# EAGLE schematic bb-meter-mk-1.0 (EAGLE 6.5.0)
DESIGNER: schizobovine <sean@yak.net
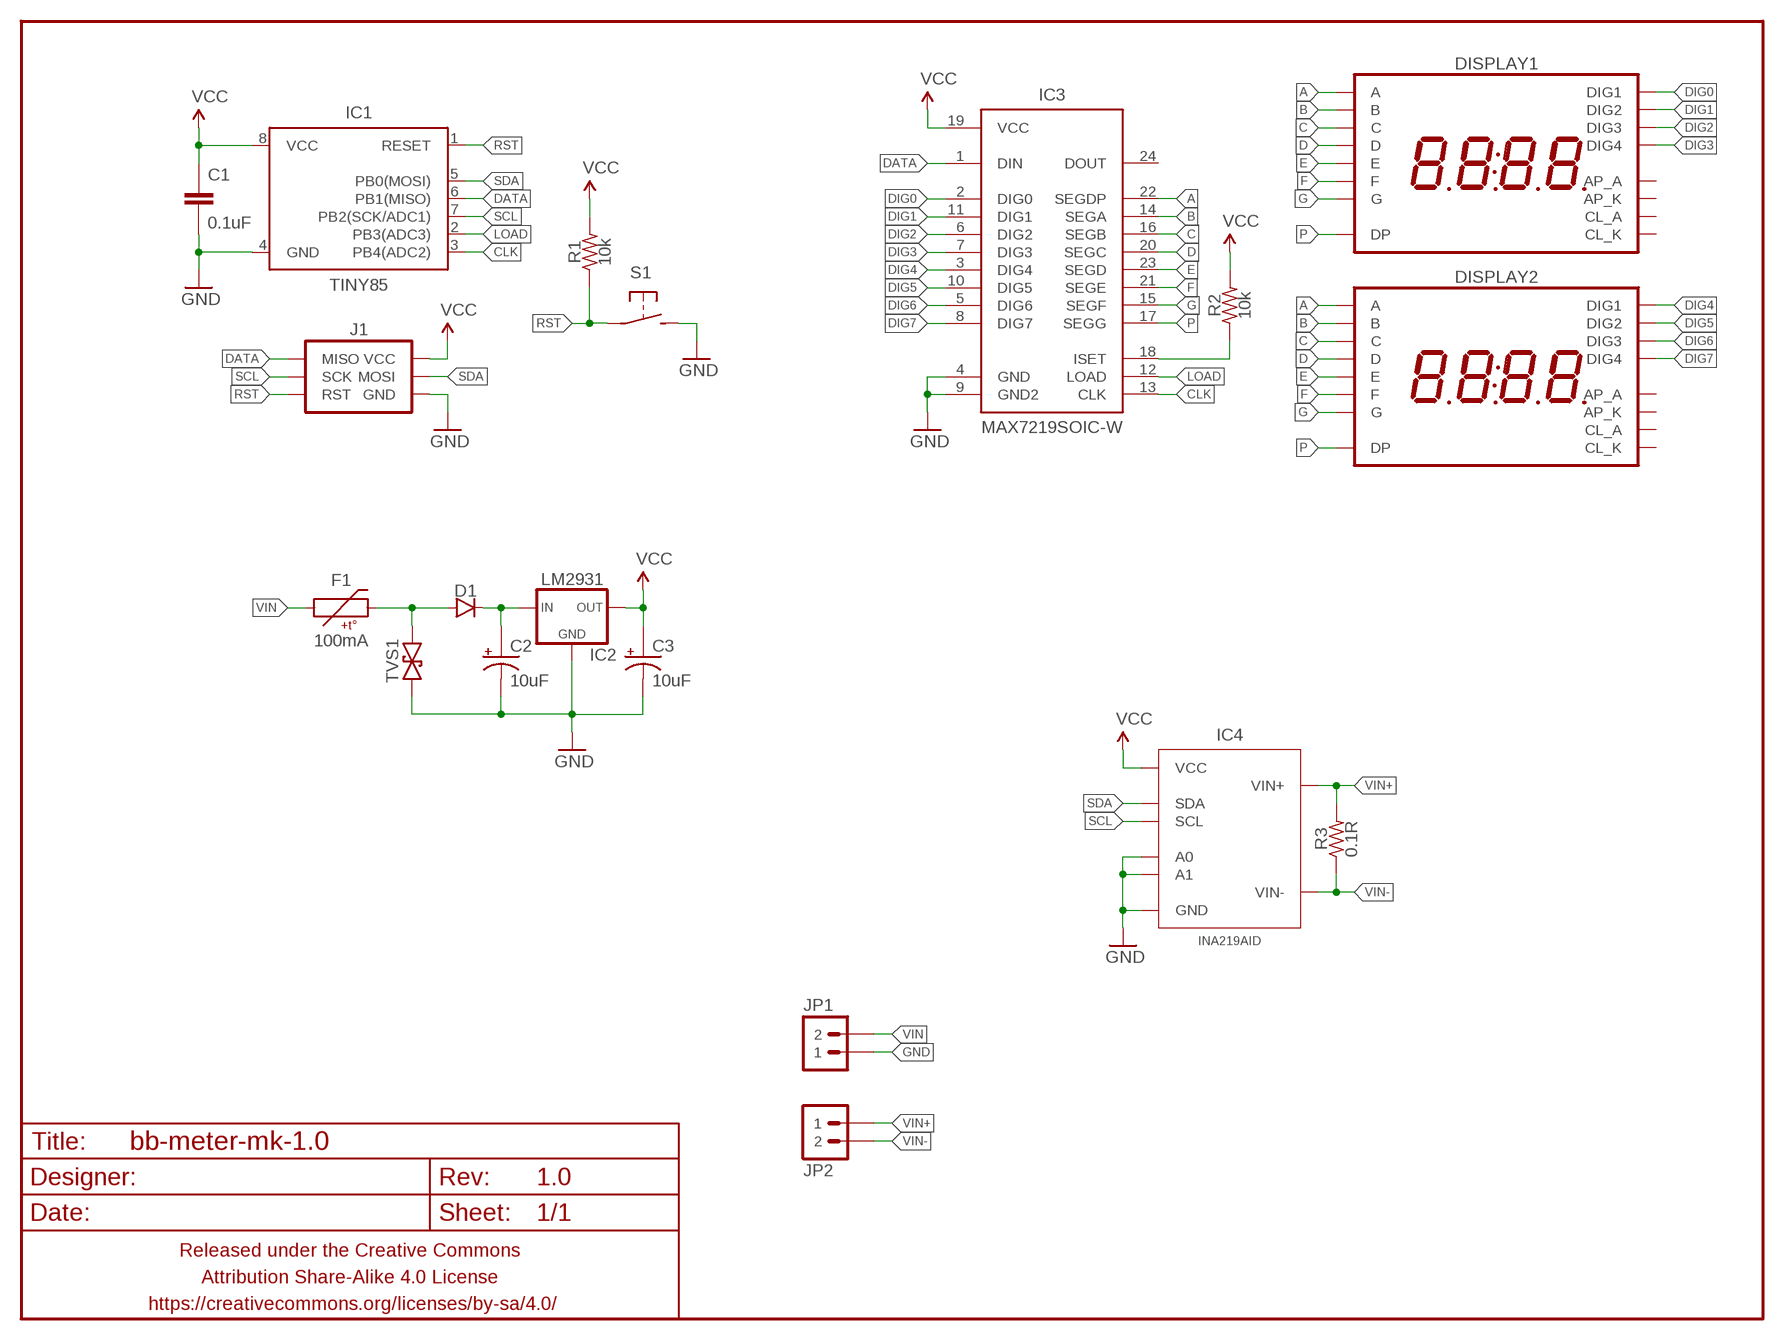
[diagram p0: schematic, sheet 1]

## Parts
C1  0.1uF  CAPACITOR-CERAMIC025-024X044  [C025-024X044]
C2  10uF  CAPACITOR-POLARIZEDE2.5-5  [E2,5-5]
C3  10uF  CAPACITOR-POLARIZEDE2.5-5  [E2,5-5]
D1  DIODEPTH-10.68MM  [DIODE-10.16MM]
DISPLAY1  7SEG_4DIGIT_COLON_APOS  [7SEG_4DIG_10MM]
DISPLAY2  7SEG_4DIGIT_COLON_APOS  [7SEG_4DIG_10MM]
F1  100mA  PTCPTH-5.08MM  [PTC-PTH-5.08MM]
FRAME1  FRAME-LETTERNO_PACKAGE  [DUMMY]
IC1  TINY85  ATTINY45TINY85-20-DIP  [DIP08]
IC2  LM2931  V_REG_78XXTO-92-INLINE  [TO-92-AMMO]
IC3  MAX7219SOIC-W  [SO24W]
IC4  INA219AID  INA219SOIC8  [SO08]
J1  AVR_SPI_PRG_6PTH  [2X3]
JP1  M02PTH-CENTERED-R+  [1X02-CENTER-R+]
JP2  M02PTH-CENTERED  [1X02-CENTER]
R1  10k  RESISTORPTH-AXIAL-6.35MM  [RESISTOR-AXIAL-PTH-6.35MM]
R2  10k  RESISTORR0805  [R0805]
R3  0.1R  RESISTORPTH-AXIAL-10.16MM  [RESISTOR-AXIAL-PTH-10.16MM]
S1  SPST-NO-TACT6MM-PTH-SMALL-PADS  [DTS-6-SMALL-PADS]
TVS1  TVSDO-41-10.16MM  [DO-41-TVS-BI-10.16MM]

## Nets
A: DISPLAY1.14(A) DISPLAY2.14(A) IC3.22(SEGDP)
B: DISPLAY1.16(B) DISPLAY2.16(B) IC3.14(SEGA)
C: DISPLAY1.13(C) DISPLAY2.13(C) IC3.16(SEGB)
CLK: IC1.3(PB4(ADC2)) IC3.13(CLK)
D: DISPLAY1.3(D) DISPLAY2.3(D) IC3.20(SEGC)
DATA: IC1.6(PB1(MISO)) IC3.1(DIN) J1.1(MISO)
DIG0: DISPLAY1.1(DIG1) IC3.2(DIG0)
DIG1: DISPLAY1.2(DIG2) IC3.11(DIG1)
DIG2: DISPLAY1.6(DIG3) IC3.6(DIG2)
DIG3: DISPLAY1.8(DIG4) IC3.7(DIG3)
DIG4: DISPLAY2.1(DIG1) IC3.3(DIG4)
DIG5: DISPLAY2.2(DIG2) IC3.10(DIG5)
DIG6: DISPLAY2.6(DIG3) IC3.5(DIG6)
DIG7: DISPLAY2.8(DIG4) IC3.8(DIG7)
E: DISPLAY1.5(E) DISPLAY2.5(E) IC3.23(SEGD)
F: DISPLAY1.11(F) DISPLAY2.11(F) IC3.21(SEGE)
G: DISPLAY1.15(G) DISPLAY2.15(G) IC3.15(SEGF)
GND: C1.2 C2.- C3.- IC1.4(GND) IC2.2(GND) IC3.4(GND) IC3.9(GND2) IC4.1(A1) IC4.2(A0) IC4.6(GND) J1.6(GND) JP1.1 S1.3 S1.4 TVS1.P$1
LOAD: IC1.2(PB3(ADC3)) IC3.12(LOAD)
N$2: IC3.18(ISET) R2.1
N$7: D1.A F1.P$2 TVS1.P$2
N$8: C2.+ D1.C IC2.1(IN)
P: DISPLAY1.7(DP) DISPLAY2.7(DP) IC3.17(SEGG)
RST: IC1.1(RESET) J1.5(RST) R1.P$1 S1.1 S1.2
SCL: IC1.7(PB2(SCK/ADC1)) IC4.4(SCL) J1.3(SCK)
SDA: IC1.5(PB0(MOSI)) IC4.3(SDA) J1.4(MOSI)
VCC: C1.1 C3.+ IC1.8(VCC) IC2.3(OUT) IC3.19(VCC) IC4.5(VCC) J1.2(VCC) R1.P$2 R2.2
VIN: F1.P$1 JP1.2
VIN+: IC4.8(VIN+) JP2.1 R3.P$2
VIN-: IC4.7(VIN-) JP2.2 R3.P$1
Unconnected: DISPLAY1.4(CL_A) DISPLAY1.9(AP_K) DISPLAY1.10(AP_A) DISPLAY1.12(CL_K) DISPLAY2.4(CL_A) DISPLAY2.9(AP_K) DISPLAY2.10(AP_A) DISPLAY2.12(CL_K) IC3.24(DOUT)

## Library data of the parts
C1 = A_butts:CAPACITOR-CERAMIC: CAPACITOR, European symbol
C2 C3 = A_butts:CAPACITOR-POLARIZED: POLARIZED CAPACITOR, American symbol
D1 = A_butts:DIODE: Diode These are standard reverse protection diodes and small signal diodes. SMA package can handle up to about 1A. SOD-323 can handle about 200mA. What the SOD-323 package when ordering, there are some mfgs out there that are 5-pin packages.
DISPLAY1 DISPLAY2 = A_butts:7SEG_4DIGIT_COLON_APOS
F1 = A_butts:PTC: Resettable Fuse PTC Resettable Fuse. Spark Fun Electronics SKU : COM-08357
FRAME1 = A_butts:FRAME-LETTER: Schematic Frame Standard 8.5x11 US Letter frame; DESIGNER: schizobovine; VERSION: 1.0
IC1 = A_butts:ATTINY45: Atmel 8-pin 2/4/8kB flash uC; PROD_ID: IC-09445; VALUE: TINY85-20-DIP
IC2 = A_butts:V_REG_78XX: Voltage Regulator Standard 7805 5V regulator. IGO (Input Ground Output). Spark Fun Electronics SKU : COM-00107
IC3 = A_butts:MAX7219: 8-digit, 8-segment LED display driver, serial input
IC4 = A_butts:INA219
J1 = A_butts:AVR_SPI_PRG_6: AVR ISP 6 Pin This is the reduced ISP connector for AVR programming. Common on Arduino. This footprint will take up less PCB space and can be used with a 10-pin to 6-pin adapter such as SKU: BOB-08508 **Special note about "TEST_POINT" package. The stop mask is on the top side, so if you want your programming test points to be on the bottom of your board, make sure to place this package on the bottom side of the board. This also ensure that the orientation to program from the bottom side will be correct.
JP1 JP2 = A_butts:M02: Standard 2-pin 0.1" header. Use with - straight break away headers ( PRT-00116) - right angle break away headers (PRT-00553) - swiss pins (PRT-00743) - machine pins (PRT-00117) - female headers (PRT-00115) Molex polarized connector foot print use with: PRT-08233 with associated crimp pins and housings. 2.54_SCREWTERM for use with PRT-10571. 3.5mm Screw Terminal footprints for PRT-08084 5mm Screw Terminal footprints for use with PRT-08433
R1-R3 = A_butts:RESISTOR: RESISTOR, American symbol
S1 = A_butts:SPST-NO-TACT
TVS1 = A_butts:TVS: Transient voltage suppressor- prevents ESD on inputs. Ignore package description- MBRA140 is NOT this type of part!!!